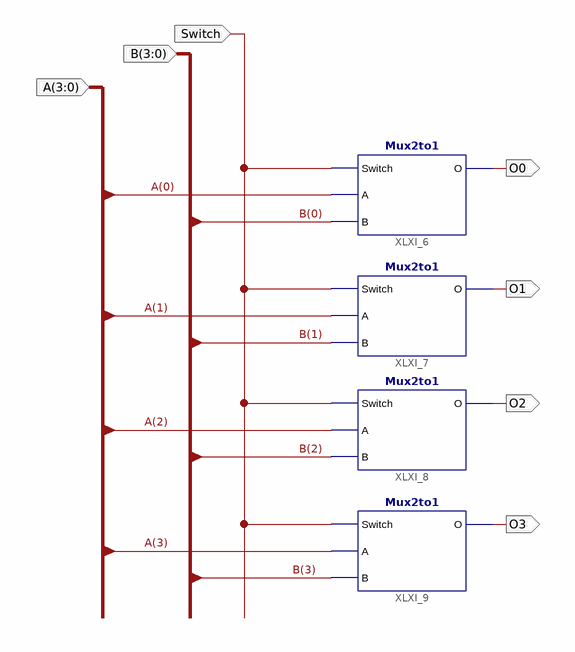
[diagram p0: schematic sheet 1]
// Xilinx ISE schematic Mux2to1_4Bit.sch (spartan3e) as structural Verilog: 4 symbols, 7 ports
module Mux2to1_4Bit (
  input  [3:0] B,
  input  Switch,
  input  [3:0] A,
  output O0,
  output O1,
  output O2,
  output O3
);

  Mux2to1 XLXI_6 (.Switch(Switch), .A(A[0]), .B(B[0]), .O(O0));
  Mux2to1 XLXI_7 (.Switch(Switch), .A(A[1]), .B(B[1]), .O(O1));
  Mux2to1 XLXI_8 (.Switch(Switch), .A(A[2]), .B(B[2]), .O(O2));
  Mux2to1 XLXI_9 (.Switch(Switch), .A(A[3]), .B(B[3]), .O(O3));
endmodule
